# Altium schematic sheet ETH.SchDoc: LED Cube 8x8x8 - Ethernet
size A4; Author: Luka Penger; CompanyName: L. Penger; DrawnBy: Luka Penger; Organization: L. Penger; Address1: Luka Penger; Address2: http://lukapenger.eu; Address3: Software & Hardware; Address4: Development; DocumentNumber: 4; Revision: 2.0.0; SheetNumber: 4; SheetTotal: 4; DocumentName: ETH; ProjectName: LED Cube 8x8x8
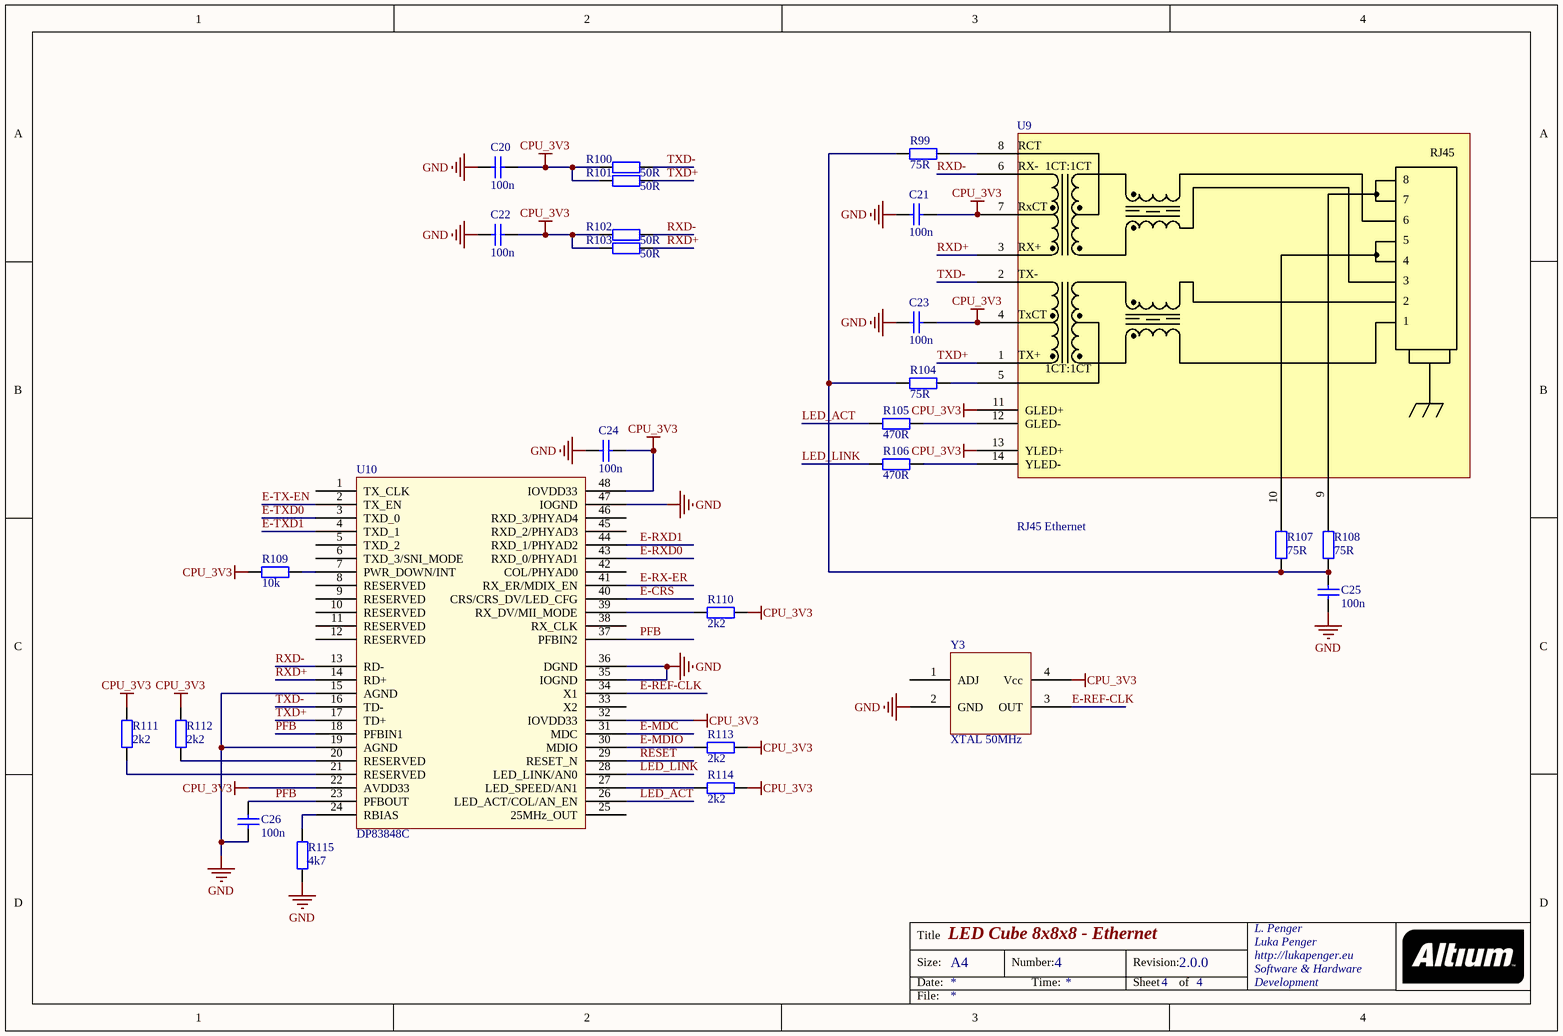
[diagram p0: ETH.SchDoc]

## Parts
C20  100n  [1608[0603]]
C21  100n  [1608[0603]]
C22  100n  [1608[0603]]
C23  100n  [1608[0603]]
C24  100n  [1608[0603]]
C25  100n  [1608[0603]]
C26  100n  [6-0805_L]
R99  75R  [1608[0603]]
R100  50R  [1608[0603]]
R101  50R  [1608[0603]]
R102  50R  [1608[0603]]
R103  50R  [1608[0603]]
R104  75R  [1608[0603]]
R105  470R  [1608[0603]]
R106  470R  [1608[0603]]
R107  75R  [1608[0603]]
R108  75R  [1608[0603]]
R109  10k  [1608[0603]]
R110  2k2  [1608[0603]]
R111  2k2  [1608[0603]]
R112  2k2  [1608[0603]]
R113  2k2  [1608[0603]]
R114  2k2  [1608[0603]]
R115  4k7  [1608[0603]]
U9  RJ45 Ethernet  [RJ45 Ethernet connector]
U10  DP83848C  [DP83848C]
Y3  XTAL 50MHz  [XTAL ACT9200]

## Nets
CPU_3V3: C20.2 C21.2 C22.2 C23.2 C24.2 R100.2 R101.2 R102.2 R103.2 R109.2 R110.1 R111.1 R112.2 R113.1 R114.1 U9.4 U9.7 U9.11(GLED+) U9.13(YLED+) U10.22(AVDD33) U10.32(IOVDD33) U10.48(IOVDD33) Y3.4(Vcc)
GND: C20.1 C21.1 C22.1 C23.1 C24.1 C25.2 C26.2 R115.2 U10.15(AGND) U10.19(AGND) U10.35(IOGND) U10.36(DGND) U10.47(IOGND) Y3.2(GND)
E-CRS: U10.40(CRS/CRS_DV/LED_CFG)
E-MDC: U10.31(MDC)
E-MDIO: R113.2 U10.30(MDIO)
E-REF-CLK: U10.34(X1) Y3.3(OUT)
E-RX-ER: U10.41(RX_ER/MDIX_EN)
E-RXD0: U10.43(RXD_0/PHYAD1)
E-RXD1: U10.44(RXD_1/PHYAD2)
E-TX-EN: U10.2(TX_EN)
E-TXD0: U10.3(TXD_0)
E-TXD1: U10.4(TXD_1)
LED_ACT: R105.2 U10.26(LED_ACT/COL/AN_EN)
LED_LINK: R106.2 U10.28(LED_LINK/AN0)
PFB: C26.1 U10.18(PFBIN1) U10.23(PFBOUT) U10.37(PFBIN2)
RESET: U10.29(RESET_N)
RXD+: R103.1 U9.3 U10.14(RD+)
RXD-: R102.1 U9.6 U10.13(RD-)
TXD+: R101.1 U9.1 U10.17(TD+)
TXD-: R100.1 U9.2 U10.16(TD-)
NetC25_1: C25.1 R99.2 R104.2 R107.1 R108.1
NetR99_1: R99.1 U9.8
NetR104_1: R104.1 U9.5
NetR105_1: R105.1 U9.12(GLED-)
NetR106_1: R106.1 U9.14(YLED-)
NetR107_2: R107.2 U9.10
NetR108_2: R108.2 U9.9
NetR109_1: R109.1 U10.7(PWR_DOWN/INT)
NetR110_2: R110.2 U10.39(RX_DV/MII_MODE)
NetR111_2: R111.2 U10.21(RESERVED)
NetR112_1: R112.1 U10.20(RESERVED)
NetR114_2: R114.2 U10.27(LED_SPEED/AN1)
NetR115_1: R115.1 U10.24(RBIAS)

Not connected (* = marked no-connect by the designer): U10 1(TX_CLK) 5(TXD_2) 6(TXD_3/SNI_MODE) 8(RESERVED) 9(RESERVED) 10(RESERVED) 11(RESERVED) 12(RESERVED) 25(25MHz_OUT) 33(X2) 38(RX_CLK) 42(COL/PHYAD0) 45(RXD_2/PHYAD3) 46(RXD_3/PHYAD4); Y3 1(ADJ)

## Notes on the sheet
- Title
- Size:
- Date:
- A4
- Number:
- Time:
- Revision:
- Sheet
- of
- File:
- (in symbol RJ45 Ethernet) RCT; RJ45; RX-; 1CT:1CT; RxCT; RX+; TX-; TxCT; TX+

## Library data of the parts
C20-C26 = Cap: Capacitor; Value: 100pF; Published: 8-Jun-2000; LatestRevisionDate: 17-Jul-2002; LatestRevisionNote: Re-released for DXP Platform.; PackageReference: RAD-0.3; Publisher: Altium Limited; PackageDescription: Radial Cap, Thru-Hole; 2 Leads; 0.3 in Pin Spacing
R99-R115 = Res2: Resistor; Value: 1K; Published: 8-Jun-2000; LatestRevisionDate: 17-Jul-2002; LatestRevisionNote: Re-released for DXP Platform.; PackageReference: AXIAL-0.4; Publisher: Altium Limited; PackageDescription: Axial Device, Thru-Hole; 2 Leads; 0.4 in Pin Spacing
U9 = RJ45 Ethernet: Ethernet Connector
U10 = DP83848C: Ethernet PHY
Y3 = XTAL ACT9200